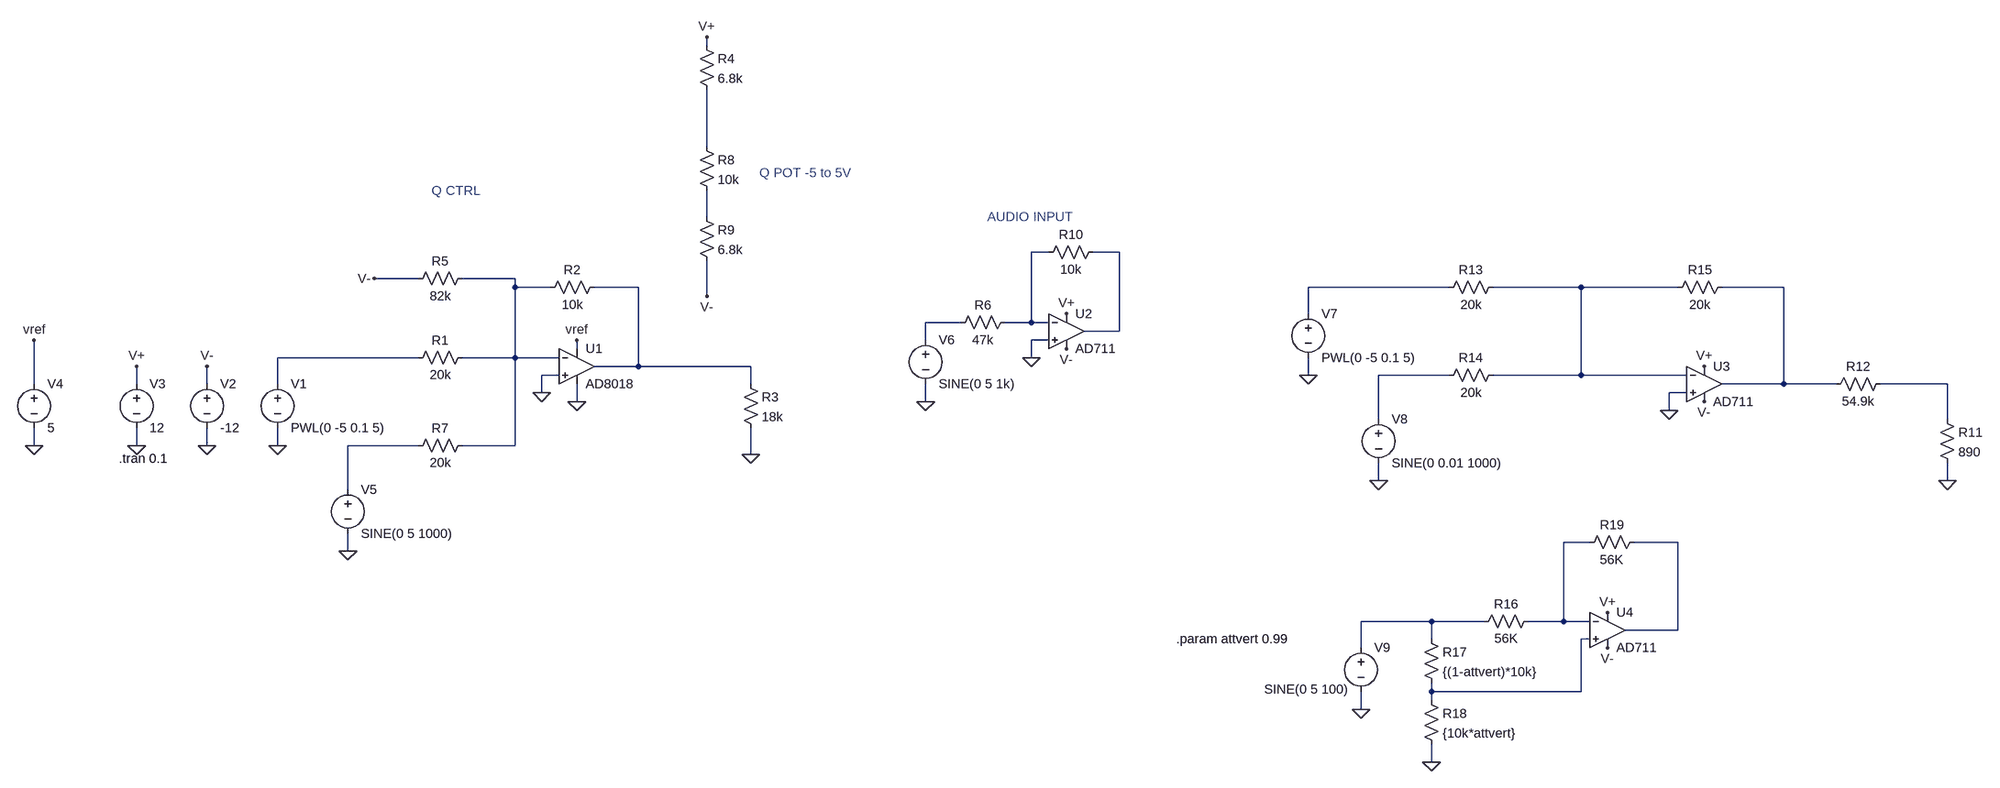
[diagram p0: schematic vcf interface circuits.asc]
vcf interface circuits.asc, the LTspice schematic file:
Version 4.1
SHEET 1 3604 836
WIRE 928 -496 928 -512
WIRE 928 -304 928 -416
WIRE 928 -176 928 -224
WIRE 1568 -112 1536 -112
WIRE 1696 -112 1648 -112
WIRE 352 -64 272 -64
WIRE 528 -64 432 -64
WIRE 528 -48 528 -64
WIRE 592 -48 528 -48
WIRE 752 -48 672 -48
WIRE 2592 -48 2336 -48
WIRE 2832 -48 2672 -48
WIRE 3008 -48 2832 -48
WIRE 3200 -48 3088 -48
WIRE 928 -32 928 -96
WIRE 2336 0 2336 -48
WIRE 1408 16 1344 16
WIRE 1536 16 1536 -112
WIRE 1536 16 1488 16
WIRE 1568 16 1536 16
WIRE 1696 32 1696 -112
WIRE 1696 32 1632 32
WIRE 1344 48 1344 16
WIRE 1568 48 1536 48
WIRE 640 64 640 48
WIRE 352 80 96 80
WIRE 528 80 528 -48
WIRE 528 80 432 80
WIRE 608 80 528 80
WIRE 1536 80 1536 48
WIRE 752 96 752 -48
WIRE 752 96 672 96
WIRE 1008 96 752 96
WIRE 608 112 576 112
WIRE 2336 112 2336 80
WIRE 2592 112 2464 112
WIRE 2832 112 2832 -48
WIRE 2832 112 2672 112
WIRE 3024 112 2832 112
WIRE -368 128 -368 48
WIRE -160 128 -160 96
WIRE -32 128 -32 96
WIRE 96 128 96 80
WIRE 1008 128 1008 96
WIRE 3200 128 3200 -48
WIRE 3200 128 3088 128
WIRE 3296 128 3200 128
WIRE 3536 128 3376 128
WIRE 576 144 576 112
WIRE 3024 144 2992 144
WIRE 640 160 640 128
WIRE 1344 160 1344 128
WIRE 2992 176 2992 144
WIRE 2464 192 2464 112
WIRE 3536 192 3536 128
WIRE -368 240 -368 208
WIRE -160 240 -160 208
WIRE -32 240 -32 208
WIRE 96 240 96 208
WIRE 352 240 224 240
WIRE 528 240 528 80
WIRE 528 240 432 240
WIRE 1008 256 1008 208
WIRE 2464 304 2464 272
WIRE 3536 304 3536 272
WIRE 224 320 224 240
WIRE 2848 416 2800 416
WIRE 3008 416 2928 416
WIRE 224 432 224 400
WIRE 2560 560 2432 560
WIRE 2656 560 2560 560
WIRE 2800 560 2800 416
WIRE 2800 560 2736 560
WIRE 2848 560 2800 560
WIRE 3008 576 3008 416
WIRE 3008 576 2912 576
WIRE 2560 592 2560 560
WIRE 2848 592 2832 592
WIRE 2432 608 2432 560
WIRE 2560 688 2560 672
WIRE 2832 688 2832 592
WIRE 2832 688 2560 688
WIRE 2560 704 2560 688
WIRE 2432 720 2432 688
WIRE 2560 816 2560 784
FLAG 96 240 0
FLAG -32 240 0
FLAG -160 240 0
FLAG -32 96 V-
FLAG -160 96 V+
FLAG 576 144 0
FLAG -368 240 0
FLAG -368 48 vref
FLAG 224 432 0
FLAG 928 -32 V-
FLAG 1008 256 0
FLAG 640 160 0
FLAG 640 48 vref
FLAG 272 -64 V-
FLAG 928 -512 V+
FLAG 1600 64 V-
FLAG 1600 0 V+
FLAG 1536 80 0
FLAG 1344 160 0
FLAG 3536 304 0
FLAG 3056 160 V-
FLAG 3056 96 V+
FLAG 2992 176 0
FLAG 2336 112 0
FLAG 2464 304 0
FLAG 2880 608 V-
FLAG 2880 544 V+
FLAG 2432 720 0
FLAG 2560 816 0
SYMBOL voltage 96 112 R0
WINDOW 123 0 0 Left 0
WINDOW 39 0 0 Left 0
SYMATTR InstName V1
SYMATTR Value PWL(0 -5 0.1 5)
SYMBOL voltage -32 112 R0
WINDOW 123 0 0 Left 0
WINDOW 39 0 0 Left 0
SYMATTR InstName V2
SYMATTR Value -12
SYMBOL voltage -160 112 R0
WINDOW 123 0 0 Left 0
WINDOW 39 0 0 Left 0
SYMATTR InstName V3
SYMATTR Value 12
SYMBOL res 448 64 R90
WINDOW 0 0 56 VBottom 2
WINDOW 3 32 56 VTop 2
SYMATTR InstName R1
SYMATTR Value 20k
SYMBOL res 688 -64 R90
WINDOW 0 0 56 VBottom 2
WINDOW 3 32 56 VTop 2
SYMATTR InstName R2
SYMATTR Value 10k
SYMBOL res 448 -80 R90
WINDOW 0 0 56 VBottom 2
WINDOW 3 32 56 VTop 2
SYMATTR InstName R5
SYMATTR Value 82k
SYMBOL voltage -368 112 R0
WINDOW 123 0 0 Left 0
WINDOW 39 0 0 Left 0
SYMATTR InstName V4
SYMATTR Value 5
SYMBOL voltage 224 304 R0
WINDOW 123 0 0 Left 0
WINDOW 39 0 0 Left 0
SYMATTR InstName V5
SYMATTR Value SINE(0 5 1000)
SYMBOL res 448 224 R90
WINDOW 0 0 56 VBottom 2
WINDOW 3 32 56 VTop 2
SYMATTR InstName R7
SYMATTR Value 20k
SYMBOL res 912 -320 R0
SYMATTR InstName R8
SYMATTR Value 10k
SYMBOL res 912 -192 R0
SYMATTR InstName R9
SYMATTR Value 6.8k
SYMBOL res 992 112 R0
SYMATTR InstName R3
SYMATTR Value 18k
SYMBOL OpAmps\\AD8018 640 32 R0
SYMATTR InstName U1
SYMBOL res 912 -512 R0
SYMATTR InstName R4
SYMATTR Value 6.8k
SYMBOL OpAmps\\AD711 1600 -32 R0
SYMATTR InstName U2
SYMBOL res 1504 0 R90
WINDOW 0 0 56 VBottom 2
WINDOW 3 32 56 VTop 2
SYMATTR InstName R6
SYMATTR Value 47k
SYMBOL res 1664 -128 R90
WINDOW 0 0 56 VBottom 2
WINDOW 3 32 56 VTop 2
SYMATTR InstName R10
SYMATTR Value 10k
SYMBOL voltage 1344 32 R0
WINDOW 123 0 0 Left 0
WINDOW 39 0 0 Left 0
SYMATTR InstName V6
SYMATTR Value SINE(0 5 1k)
SYMBOL res 3520 176 R0
SYMATTR InstName R11
SYMATTR Value 890
SYMBOL res 3392 112 R90
WINDOW 0 0 56 VBottom 2
WINDOW 3 32 56 VTop 2
SYMATTR InstName R12
SYMATTR Value 54.9k
SYMBOL OpAmps\\AD711 3056 64 R0
SYMATTR InstName U3
SYMBOL voltage 2336 -16 R0
WINDOW 123 0 0 Left 0
WINDOW 39 0 0 Left 0
SYMATTR InstName V7
SYMATTR Value PWL(0 -5 0.1 5)
SYMBOL voltage 2464 176 R0
WINDOW 123 0 0 Left 0
WINDOW 39 0 0 Left 0
SYMATTR InstName V8
SYMATTR Value SINE(0 0.01 1000)
SYMBOL res 2688 -64 R90
WINDOW 0 0 56 VBottom 2
WINDOW 3 32 56 VTop 2
SYMATTR InstName R13
SYMATTR Value 20k
SYMBOL res 2688 96 R90
WINDOW 0 0 56 VBottom 2
WINDOW 3 32 56 VTop 2
SYMATTR InstName R14
SYMATTR Value 20k
SYMBOL res 3104 -64 R90
WINDOW 0 0 56 VBottom 2
WINDOW 3 32 56 VTop 2
SYMATTR InstName R15
SYMATTR Value 20k
SYMBOL OpAmps\\AD711 2880 512 R0
SYMATTR InstName U4
SYMBOL res 2752 544 R90
WINDOW 0 0 56 VBottom 2
WINDOW 3 32 56 VTop 2
SYMATTR InstName R16
SYMATTR Value 56K
SYMBOL voltage 2432 592 R0
WINDOW 3 -176 92 Left 2
WINDOW 123 0 0 Left 0
WINDOW 39 0 0 Left 0
SYMATTR InstName V9
SYMATTR Value SINE(0 5 100)
SYMBOL res 2544 576 R0
SYMATTR InstName R17
SYMATTR Value {(1-attvert)*10k}
SYMBOL res 2544 688 R0
SYMATTR InstName R18
SYMATTR Value {10k*attvert}
SYMBOL res 2944 400 R90
WINDOW 0 0 56 VBottom 2
WINDOW 3 32 56 VTop 2
SYMATTR InstName R19
SYMATTR Value 56K
TEXT -192 264 Left 2 !.tran 0.1
TEXT 376 -224 Left 2 ;Q CTRL
TEXT 1024 -256 Left 2 ;Q POT -5 to 5V
TEXT 1456 -176 Left 2 ;AUDIO INPUT
TEXT 2096 592 Left 2 !.param attvert 0.99

The netlist it stands for:
* vcf interface circuits.asc
V1 N011 0 PWL(0 -5 0.1 5)
V2 V- 0 -12
V3 V+ 0 12
R1 N005 N011 20k
R2 N006 N005 10k
R5 N005 V- 82k
V4 vref 0 5
V5 N014 0 SINE(0 5 1000)
R7 N005 N014 20k
R8 N001 N002 10k
R9 N002 V- 6.8k
R3 N006 0 18k
X§U1 0 N005 vref 0 N006 AD8018  ; pins In+ In- V+ V- OUT
R4 V+ N001 6.8k
X§U2 0 N003 V+ V- N004 AD712  ; AD711, pins In+ In- V+ V- OUT
R6 N003 N010 47k
R10 N004 N003 10k
V6 N010 0 SINE(0 5 1k)
R11 N013 0 890
R12 N013 N009 54.9k
X§U3 0 N008 V+ V- N009 AD712  ; AD711, pins In+ In- V+ V- OUT
V7 N007 0 PWL(0 -5 0.1 5)
V8 N012 0 SINE(0 0.01 1000)
R13 N008 N007 20k
R14 N008 N012 20k
R15 N009 N008 20k
X§U4 N018 N015 V+ V- N016 AD712  ; AD711, pins In+ In- V+ V- OUT
R16 N015 N017 56K
V9 N017 0 SINE(0 5 100)
R17 N017 N018 {(1-attvert)*10k}
R18 N018 0 {10k*attvert}
R19 N016 N015 56K
.tran 0.1
* Q CTRL
* Q POT -5 to 5V
* AUDIO INPUT
.param attvert 0.99
.lib ADI1.lib
.backanno
.end